# Altium schematic sheet USB.SchDoc
size A
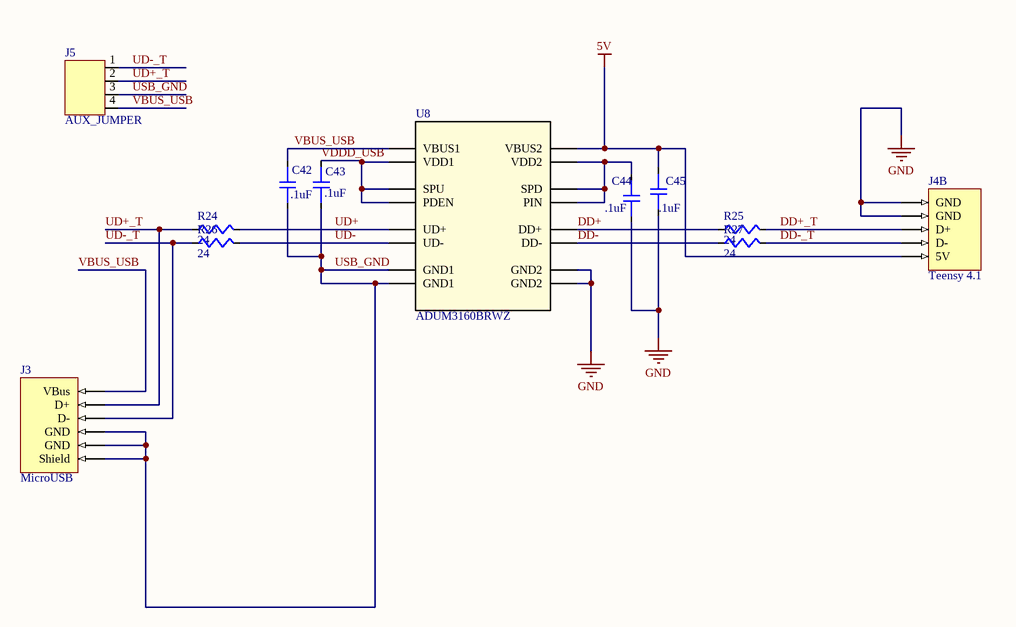
[diagram p0: USB.SchDoc]

## Parts
C42  .1uF  [C0603]
C43  .1uF  [C0603]
C44  .1uF  [C0603]
C45  .1uF  [C0603]
J3  MicroUSB  [HRS_ZX62-B-5PA(33)]
J4  Teensy 4.1  [Teensy4.1]  (part B of 2)
J5  AUX_JUMPER  [headerPins_4x1]
R24  24  [C0603]
R25  24  [C0603]
R26  24  [C0603]
R27  24  [C0603]
U8  ADUM3160BRWZ  [RW_16_ADI-L]

## Nets
5V: C45.2 J4.53(5V) U8.16(VBUS2)
GND: C44.1 C45.1 J4.49(GND) J4.50(GND) U8.9(GND2) U8.15(GND2)
DD+: R25.1 U8.10(DD+)
DD+_T: J4.51(D+) R25.2
DD-: R27.1 U8.11(DD-)
DD-_T: J4.52(D-) R27.2
UD+: R24.2 U8.7(UD+)
UD+_T: J3.2(D+) J5.2(3V3) R24.1
UD-: R26.2 U8.6(UD-)
UD-_T: J3.3(D-) J5.1(GND) R26.1
USB_GND: C42.1 C43.1 J3.4(GND) J3.5(GND) J3.6(Shield) J5.3(SDA) U8.2(GND1) U8.8(GND1)
VBUS_USB: C42.2 J3.1(VBus) J5.4(SCL) U8.1(VBUS1)
VDDD_USB: C43.2 U8.3(VDD1) U8.4(PDEN) U8.5(SPU)
NetC44_2: C44.2 U8.12(PIN) U8.13(SPD) U8.14(VDD2)

## Library data of the parts
C42-C45 = VJ0603Y104JXJCW1BC: 0603 0.1 uF 16 V ±5 % Tolerance X7R SMT Multilayer Ceramic Chip Capacitor; Manufacturer 1: Vishay Vitramon; Dielectric Material: Tantalum; Tolerance: 5%; Capacitance: 100nF; Voltage Rating: 16V; Supplier 1: Digi-Key; Supplier Part Number 1: 720-1685-1-ND; Manufacturer Part Number 1: VJ0603Y104JXJCW1BC; Stock 1: 6936; Pricing 1: 1=0.20000, 10=0.13400, 100=0.06780, 500=0.04636, 1000=0.04101 (USD); RoHS: Yes; Mount: Surface Mount; Case/Package: 0603; Number of Pins: 2; Case Code (Imperial): 0603; Case Code (Metric): 1608; Contact Plating: Tin,Matte; Min Operating Temperature: -55°C; Max Operating Temperature: 125°C; Packaging: Tape and Reel; Voltage Rating (DC): 16V; Package Quantity: 4000; Dielectric: X7R; Termination: SMD/SMT; Length: 1.6mm; Height: 0.95mm; Width: 0.8mm; Depth: 0.8mm; Lead Free: Lead Free; ComponentLink1URL: https://datasheet.ciiva.com/5424/vjw1bcbascomseries-223529-5424533.pdf?src-supplier=Mouser; ComponentLink1Description: https://datasheet.ciiva.com/5424/vjw1bcbascomseries-223529-5424533.pdf?src-supplier=Mouser; ComponentLink2URL: https://datasheet.ciiva.com/11491/vjw1bcbascomseries-11491768.pdf?src-supplier=Avnet; ComponentLink2Description: https://datasheet.ciiva.com/11491/vjw1bcbascomseries-11491768.pdf?src-supplier=Avnet; ComponentLink3URL: https://datasheet.ciiva.com/16215/vjw1bcbascomseries-16215161.pdf?src-supplier=Future+Electronics; ComponentLink3Description: https://datasheet.ciiva.com/16215/vjw1bcbascomseries-16215161.pdf?src-supplier=Future+Electronics
J3 = ZX62-B-5PA(33): HIROSE(HRS) - ZX62-B-5PA(33) - USB-Steckverbinder, Micro-USB Typ B, USB 2.0, Buchse, 5 -polig, Oberflächenmontage, Rechtwinklig; Supplier 1: Digi-Key; Supplier Part Number 1: H125270CT-ND
J4 = Teensy4.1
J5 = J4: Supplier 1: Digi-Key; Supplier Part Number 1: SAM10843-ND
R24-R27 = ERJU03F24R0V: Thick Film Resistors - SMD 0603 1% 24ohm Anti-Sulfur AEC-Q200; Manufacturer 1: Panasonic; Temperature Coefficient: 100ppm/°C; Current Rating: 1A; Voltage Rating (DC): 75V; Power Rating: 100mW; Resistance: 24R; Supplier 1: Digi-Key; Supplier Part Number 1: 10-ERJ-U03F24R0VCT-ND; Manufacturer Part Number 1: ERJU03F24R0V; RoHS: Yes; Category: Chip SMD Resistors; Stock 1: 298; Pricing 1: 1=0.13000, 10=0.11400, 100=0.04400, 1000=0.01936, 2500=0.01672 (USD); Case/Package: 0603; Case Code (Imperial): 0603; Case Code (Metric): 1608; Weight: 7.1E-05oz; Min Operating Temperature: -55°C; Max Operating Temperature: 155°C; Tolerance: 1%; Voltage Rating: 75V; Packaging: Tape and Reel; Package Quantity: 5000; Resistor Type: Thick Film; Termination: SMD/SMT; Length: 1.6mm; Width: 0.8mm; Height: 0.45mm; Depth: 0.8mm; REACH SVHC: No SVHC; ComponentLink1URL: https://datasheet.ciiva.com/24124/ras-erj-u-267552-24124922.pdf?src-supplier=Mouser; ComponentLink1Description: https://datasheet.ciiva.com/24124/ras-erj-u-267552-24124922.pdf?src-supplier=Mouser; ComponentLink2URL: https://datasheet.ciiva.com/6201/1638979-6201577.pdf?src-supplier=Farnell; ComponentLink2Description: https://datasheet.ciiva.com/6201/1638979-6201577.pdf?src-supplier=Farnell
U8 = ADUM3160BRWZ: USB Isolation; SourceLibrary: Analog_2015-12-15; Built_By: EMA_UL_Team; Vendor: Analog Devices Inc; Manufacturer_Part_Number: ADUM3160BRWZ; Copyright: Copyright (C) 2018 Accelerated Designs. All rights reserved; RefDes: RefDes; Type: DEV